# Vivado block design Minimig_core_orig, xc7a200tfbg484-2, Vivado 2024.2.1
# (continued, part 2 of 3)
current_bd_instance /emu/CORE_cpu_wrapper/CORE_cpu_wrapper_cpu_inst_p/CORE_cpu_inst_p_TG68K_ALU

# ---- hierarchy /emu/CORE_cpu_wrapper/CORE_cpu_wrapper_cpu_inst_o ----
current_bd_instance /emu/CORE_cpu_wrapper/CORE_cpu_wrapper_cpu_inst_o
create_bd_pin -dir I clk
create_bd_pin -dir I HALTn
create_bd_pin -dir I extReset
create_bd_pin -dir I pwrUp
create_bd_pin -dir I enPhi1
create_bd_pin -dir I enPhi2
create_bd_pin -dir O eRWn
create_bd_pin -dir O ASn
create_bd_pin -dir O LDSn
create_bd_pin -dir O UDSn
create_bd_pin -dir O E
create_bd_pin -dir O VMAn
create_bd_pin -dir O E_PosClkEn
create_bd_pin -dir O E_NegClkEn
create_bd_pin -dir O FC0
create_bd_pin -dir O FC1
create_bd_pin -dir O FC2
create_bd_pin -dir O BGn
create_bd_pin -dir O oRESETn
create_bd_pin -dir O oHALTEDn
create_bd_pin -dir I DTACKn
create_bd_pin -dir I VPAn
create_bd_pin -dir I BERRn
create_bd_pin -dir I BRn
create_bd_pin -dir I BGACKn
create_bd_pin -dir I IPL0n
create_bd_pin -dir I IPL1n
create_bd_pin -dir I IPL2n
create_bd_pin -dir I -from 15 -to 0 iEdb
create_bd_pin -dir I -from 15 -to 0 oEdb
create_bd_pin -dir O -from 23 -to 1 eab

# ---- hierarchy /emu/CORE_cpu_wrapper/ipl_logic ----
current_bd_instance /emu/CORE_cpu_wrapper/ipl_logic
create_bd_pin -dir I -from 2 -to 0 chip_ipl
create_bd_pin -dir O IPL0n
create_bd_pin -dir O IPL1n
create_bd_pin -dir O IPL2n
create_bd_pin -dir O -from 2 -to 0 IPL

# ---- hierarchy /emu/CORE_cpu_wrapper/iEdb_logic ----
current_bd_instance /emu/CORE_cpu_wrapper/iEdb_logic
create_bd_pin -dir O -from 15 -to 0 iEDB
create_bd_pin -dir I -from 15 -to 0 fastchip_dout
create_bd_pin -dir I -from 15 -to 0 chip_dout
create_bd_pin -dir I -from 15 -to 0 ramdout
create_bd_pin -dir I -from 7 -to 0 fastramcfg

# ---- hierarchy /emu/CORE_cpu_wrapper/clkene_in_logic ----
current_bd_instance /emu/CORE_cpu_wrapper/clkene_in_logic
create_bd_pin -dir O clkena_in
create_bd_pin -dir I fastchip_ready
create_bd_pin -dir I ramready

# ---- hierarchy /emu/CORE_cpu_wrapper/DTACKn_logic ----
current_bd_instance /emu/CORE_cpu_wrapper/DTACKn_logic
create_bd_pin -dir O DTACKn
create_bd_pin -dir I fastchip_selack
create_bd_pin -dir I chip_dtack

# ---- hierarchy /emu/CORE_cpu_wrapper/cpustate_logic ----
current_bd_instance /emu/CORE_cpu_wrapper/cpustate_logic
create_bd_pin -dir O -from 1 -to 0 cpustate
create_bd_pin -dir I -from 1 -to 0 busstate
create_bd_pin -dir I ASn

# ---- hierarchy /emu/CORE_cpu_wrapper/VPAn_logic ----
current_bd_instance /emu/CORE_cpu_wrapper/VPAn_logic
create_bd_pin -dir O VPAn
create_bd_pin -dir I FC0
create_bd_pin -dir I FC1
create_bd_pin -dir I FC2

# ---- hierarchy /emu/CORE_cpu_wrapper/ramdout_logic ----
current_bd_instance /emu/CORE_cpu_wrapper/ramdout_logic
create_bd_pin -dir I -from 15 -to 0 ramdout
create_bd_pin -dir O -from 15 -to 0 data_in
create_bd_pin -dir O -from 15 -to 0 ramdout_o

# ---- hierarchy /emu/CORE_cpu_wrapper/fastchip_rnw_logic ----
current_bd_instance /emu/CORE_cpu_wrapper/fastchip_rnw_logic
create_bd_pin -dir O fastchip_rnw
create_bd_pin -dir I nWr
create_bd_pin -dir I eRWn

# ---- hierarchy /emu/CORE_cpu_wrapper/fastchip_uds_logic ----
current_bd_instance /emu/CORE_cpu_wrapper/fastchip_uds_logic
create_bd_pin -dir O fastchip_uds
create_bd_pin -dir I pnUDS
create_bd_pin -dir I o_UDSn

# ---- hierarchy /emu/CORE_cpu_wrapper/chip_uds_logic ----
current_bd_instance /emu/CORE_cpu_wrapper/chip_uds_logic
create_bd_pin -dir O chip_uds
create_bd_pin -dir I o_UDSn
create_bd_pin -dir I pnUDS

# ---- hierarchy /emu/CORE_cpu_wrapper/fastchip_lds ----
current_bd_instance /emu/CORE_cpu_wrapper/fastchip_lds
create_bd_pin -dir O fastchip_lds
create_bd_pin -dir I p_nLDS
create_bd_pin -dir I o_LDSn

# ---- hierarchy /emu/CORE_cpu_wrapper/ramlds_logic ----
current_bd_instance /emu/CORE_cpu_wrapper/ramlds_logic
create_bd_pin -dir O ramlds
create_bd_pin -dir I p_nUDS
create_bd_pin -dir I o_UDSn

# ---- hierarchy /emu/CORE_cpu_wrapper/reset_out_logic ----
current_bd_instance /emu/CORE_cpu_wrapper/reset_out_logic
create_bd_pin -dir O reset_out
create_bd_pin -dir I p_nResetOut
create_bd_pin -dir I oRESTn

# ---- hierarchy /emu/CORE_cpu_wrapper/ramuds_logic ----
current_bd_instance /emu/CORE_cpu_wrapper/ramuds_logic
create_bd_pin -dir O ramuds
create_bd_pin -dir I p_nUDS
create_bd_pin -dir I o_UDSn
create_bd_pin -dir I p_nLDS
create_bd_pin -dir I o_LDSn

# ---- hierarchy /emu/CORE_cpu_wrapper/ramaddr_logic ----
current_bd_instance /emu/CORE_cpu_wrapper/ramaddr_logic
create_bd_pin -dir O -from 28 -to 1 ramaddr
create_bd_pin -dir I bootrom
create_bd_pin -dir I -from 23 -to 1 eab

# ---- hierarchy /emu/CORE_cpu_wrapper/data_in_logic ----
current_bd_instance /emu/CORE_cpu_wrapper/data_in_logic
create_bd_pin -dir O -from 15 -to 0 data_in
create_bd_pin -dir I -from 15 -to 0 data_in_i
create_bd_pin -dir I -from 7 -to 0 fastramcfg

# ---- hierarchy /emu/CORE_video_mixer ----
current_bd_instance /emu/CORE_video_mixer
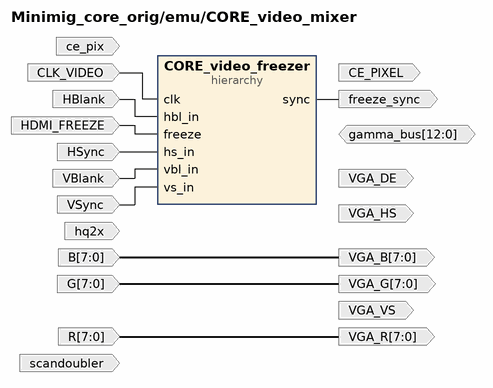
[diagram p14: block diagram inside /emu/CORE_video_mixer]
create_bd_pin -dir I CLK_VIDEO
create_bd_pin -dir O CE_PIXEL
create_bd_pin -dir I ce_pix
create_bd_pin -dir I scandoubler
create_bd_pin -dir I hq2x
create_bd_pin -dir IO -from 12 -to 0 gamma_bus
create_bd_pin -dir I -from 7 -to 0 R
create_bd_pin -dir I -from 7 -to 0 G
create_bd_pin -dir I -from 7 -to 0 B
create_bd_pin -dir I HSync
create_bd_pin -dir I VSync
create_bd_pin -dir I HBlank
create_bd_pin -dir I VBlank
create_bd_pin -dir I HDMI_FREEZE
create_bd_pin -dir O freeze_sync
create_bd_pin -dir O -from 7 -to 0 VGA_R
create_bd_pin -dir O -from 7 -to 0 VGA_G
create_bd_pin -dir O -from 7 -to 0 VGA_B
create_bd_pin -dir O VGA_VS
create_bd_pin -dir O VGA_HS
create_bd_pin -dir O VGA_DE

create_bd_cell -type hier CORE_video_freezer

# ---- hierarchy /emu/CORE_video_mixer/CORE_video_freezer ----
current_bd_instance /emu/CORE_video_mixer/CORE_video_freezer
create_bd_pin -dir I clk
create_bd_pin -dir O sync
create_bd_pin -dir I freeze
create_bd_pin -dir I hs_in
create_bd_pin -dir I vs_in
create_bd_pin -dir I hbl_in
create_bd_pin -dir I vbl_in
create_bd_pin -dir O hs_out
create_bd_pin -dir O vs_out
create_bd_pin -dir O hbl_out
create_bd_pin -dir O vbl_out

# ---- hierarchy /emu/hps_ext ----
current_bd_instance /emu/hps_ext
create_bd_pin -dir I clk_sys
create_bd_pin -dir IO -from 35 -to 0 EXT_BUS
create_bd_pin -dir O io_strobe
create_bd_pin -dir O io_fpga
create_bd_pin -dir O io_uio
create_bd_pin -dir O -from 15 -to 0 io_din
create_bd_pin -dir I -from 15 -to 0 fpga_dout
create_bd_pin -dir I -from 15 -to 0 ide_din
create_bd_pin -dir O -from 15 -to 0 ide_dout
create_bd_pin -dir O -from 4 -to 0 ide_addr
create_bd_pin -dir O ide_rd
create_bd_pin -dir O ide_wr
create_bd_pin -dir I -from 5 -to 0 ide_req
create_bd_pin -dir O -from 2 -to 0 mouse_buttons
create_bd_pin -dir O kbd_mouse_level
create_bd_pin -dir O -from 1 -to 0 kbd_mouse_type
create_bd_pin -dir O -from 7 -to 0 kbd_mouse_data
create_bd_pin -dir I -from 11 -to 0 scr_hbl_l
create_bd_pin -dir I -from 11 -to 0 scr_hbl_r
create_bd_pin -dir I -from 11 -to 0 scr_hsize
create_bd_pin -dir I -from 11 -to 0 scr_vbl_t
create_bd_pin -dir I -from 11 -to 0 scr_vbl_b
create_bd_pin -dir I -from 11 -to 0 scr_vsize
create_bd_pin -dir I -from 6 -to 0 scr_flg
create_bd_pin -dir I -from 1 -to 0 scr_res
create_bd_pin -dir O -from 11 -to 0 shbl_l
create_bd_pin -dir O -from 11 -to 0 shbl_r
create_bd_pin -dir O -from 11 -to 0 svbl_t
create_bd_pin -dir O -from 11 -to 0 svbl_b
create_bd_pin -dir O sset
create_bd_pin -dir I cdda_req
create_bd_pin -dir O cdda_wr
create_bd_pin -dir O -from 15 -to 0 cdda_dout

# ---- hierarchy /emu/iir_filter_lpf3275 ----
current_bd_instance /emu/iir_filter_lpf3275
create_bd_pin -dir I clk
create_bd_pin -dir I reset
create_bd_pin -dir I ce
create_bd_pin -dir I sample_ce
create_bd_pin -dir I -from 39 -to 0 cx
create_bd_pin -dir I -from 7 -to 0 cx0
create_bd_pin -dir I -from 7 -to 0 cx1
create_bd_pin -dir I -from 7 -to 0 cx2
create_bd_pin -dir I -from 23 -to 0 cy0
create_bd_pin -dir I -from 23 -to 0 cy1
create_bd_pin -dir I -from 23 -to 0 cy2
create_bd_pin -dir I -from 15 -to 0 input_l
create_bd_pin -dir I -from 15 -to 0 input_r
create_bd_pin -dir O -from 15 -to 0 output_l
create_bd_pin -dir O -from 15 -to 0 output_r

# ---- hierarchy /emu/iir_filter_lpf4400 ----
current_bd_instance /emu/iir_filter_lpf4400
create_bd_pin -dir I clk
create_bd_pin -dir I reset
create_bd_pin -dir I sample_ce
create_bd_pin -dir I -from 39 -to 0 cx
create_bd_pin -dir I -from 7 -to 0 cx0
create_bd_pin -dir I -from 7 -to 0 cx1
create_bd_pin -dir I -from 7 -to 0 cx2
create_bd_pin -dir I -from 23 -to 0 cy0
create_bd_pin -dir I -from 23 -to 0 cy1
create_bd_pin -dir I -from 23 -to 0 cy2
create_bd_pin -dir I -from 15 -to 0 input_l
create_bd_pin -dir I -from 15 -to 0 input_r
create_bd_pin -dir O -from 15 -to 0 output_l
create_bd_pin -dir O -from 15 -to 0 output_r
create_bd_pin -dir I ce

# ---- hierarchy /emu/Audio_logic ----
current_bd_instance /emu/Audio_logic
create_bd_pin -dir O -from 15 -to 0 AUDIO_L
create_bd_pin -dir O -from 15 -to 0 AUDIO_R
create_bd_pin -dir I -from 15 -to 0 output_l
create_bd_pin -dir I -from 15 -to 0 output_r
create_bd_pin -dir I -from 15 -to 0 cdda_audio_l
create_bd_pin -dir I -from 15 -to 0 cdda_audio_r
create_bd_pin -dir I -from 15 -to 0 toccata_aud_left
create_bd_pin -dir I -from 15 -to 0 toccata_aud_right
create_bd_pin -dir I -from 15 -to 0 mt32_i2s_r
create_bd_pin -dir I -from 15 -to 0 mt32_i2s_l

# ---- hierarchy /emu/iir_4400_logic ----
current_bd_instance /emu/iir_4400_logic
create_bd_pin -dir I -from 15 -to 0 ldata
create_bd_pin -dir O -from 15 -to 0 comb
create_bd_pin -dir I -from 15 -to 0 rdata

# ---- hierarchy /emu/iir_3275_logic ----
current_bd_instance /emu/iir_3275_logic
create_bd_pin -dir I -from 15 -to 0 comb_i
create_bd_pin -dir I -from 31 -to 0 output_l
create_bd_pin -dir I -from 15 -to 0 output_r
create_bd_pin -dir O -from 15 -to 0 comb

# ---- hierarchy /emu/iir_comb_logic ----
current_bd_instance /emu/iir_comb_logic
create_bd_pin -dir O -from 15 -to 0 output_l
create_bd_pin -dir O -from 15 -to 0 output_r
create_bd_pin -dir I -from 15 -to 0 output_l_i
create_bd_pin -dir I -from 15 -to 0 output_r_i
create_bd_pin -dir I -from 15 -to 0 comb

# ---- hierarchy /emu/amiga_clk_login ----
current_bd_instance /emu/amiga_clk_login
create_bd_pin -dir I clk7_en
create_bd_pin -dir I clk7n_en
create_bd_pin -dir O ce

# ---- hierarchy /emu/reset_logic ----
current_bd_instance /emu/reset_logic
create_bd_pin -dir I RESET
create_bd_pin -dir I pll_locked
create_bd_pin -dir I hps_io_buttons
create_bd_pin -dir O reset_o

# ---- hierarchy /emu/fastchip_reset_logic ----
current_bd_instance /emu/fastchip_reset_logic
create_bd_pin -dir O reset
create_bd_pin -dir I minimig_cpu_reset
create_bd_pin -dir I wrapper_reset_out

# ---- hierarchy /emu/cpu_wrapper_logic ----
current_bd_instance /emu/cpu_wrapper_logic
create_bd_pin -dir O -from 15 -to 0 ramdout
create_bd_pin -dir O -from 15 -to 0 ramready
create_bd_pin -dir I -from 15 -to 0 ram1_cpuRD
create_bd_pin -dir I ram1_ramready
create_bd_pin -dir I -from 15 -to 0 ram2_cpuRD
create_bd_pin -dir I ram2_ramready

# ---- hierarchy /emu/CORE_video_freak ----
current_bd_instance /emu/CORE_video_freak
create_bd_pin -dir I CLK_VIDEO
create_bd_pin -dir I CE_PIXEL
create_bd_pin -dir I VGA_VS
create_bd_pin -dir I -from 11 -to 0 HDMI_WIDTH
create_bd_pin -dir I -from 11 -to 0 HDMI_HEIGHT
create_bd_pin -dir O VGA_DE
create_bd_pin -dir O -from 12 -to 0 VIDEO_ARX
create_bd_pin -dir O -from 12 -to 0 VIDEO_ARY
create_bd_pin -dir I VGA_DE_IN
create_bd_pin -dir I -from 11 -to 0 ARX
create_bd_pin -dir I -from 11 -to 0 ARY
create_bd_pin -dir I -from 11 -to 0 CROP_SIZE
create_bd_pin -dir I -from 4 -to 0 CROP_OFF
create_bd_pin -dir I -from 2 -to 0 SCALE

# ---- hierarchy /emu/mt32pi ----
current_bd_instance /emu/mt32pi
create_bd_pin -dir I CLK_AUDIO
create_bd_pin -dir I CLK_VIDEO
create_bd_pin -dir I CE_PIXEL
create_bd_pin -dir I VGA_VS
create_bd_pin -dir I VGA_DE
create_bd_pin -dir I -from 6 -to 0 USER_IN
create_bd_pin -dir O -from 6 -to 0 USER_OUT
create_bd_pin -dir I reset
create_bd_pin -dir I midi_tx
create_bd_pin -dir O midi_rx
create_bd_pin -dir O -from 15 -to 0 mt32_i2s_r
create_bd_pin -dir O -from 15 -to 0 mt32_i2s_l
create_bd_pin -dir O mt32_available
create_bd_pin -dir I mt32_mode_req
create_bd_pin -dir I -from 1 -to 0 mt32_rom_req
create_bd_pin -dir I -from 7 -to 0 mt32_sf_req
create_bd_pin -dir O -from 7 -to 0 mt32_mode
create_bd_pin -dir O -from 7 -to 0 mt32_rom
create_bd_pin -dir O -from 7 -to 0 mt32_sf
create_bd_pin -dir O mt32_newmode
create_bd_pin -dir O mt32_lcd_en
create_bd_pin -dir O mt32_lcd_pix
create_bd_pin -dir O mt32_lcd_update

# ---- hierarchy /emu/status_menumask_logic ----
current_bd_instance /emu/status_menumask_logic
create_bd_pin -dir O -from 15 -to 0 status_menumask
create_bd_pin -dir I -from 7 -to 0 mt32_rom
create_bd_pin -dir I -from 7 -to 0 mt32_sf

# ---- hierarchy /hdmi_osd ----
current_bd_instance /hdmi_osd
create_bd_pin -dir I clk_sys
create_bd_pin -dir I io_osd
create_bd_pin -dir I io_strobe
create_bd_pin -dir I -from 15 -to 0 io_din
create_bd_pin -dir I clk_video
create_bd_pin -dir I -from 23 -to 0 din
create_bd_pin -dir I de_in
create_bd_pin -dir I vs_in
create_bd_pin -dir I hs_in
create_bd_pin -dir O -from 23 -to 0 dout
create_bd_pin -dir O de_out
create_bd_pin -dir O vs_out
create_bd_pin -dir O hs_out
create_bd_pin -dir O osd_status

# ---- hierarchy /mcp23009 ----
current_bd_instance /mcp23009
create_bd_pin -dir I clk
create_bd_pin -dir O -from 2 -to 0 btn
create_bd_pin -dir I -from 2 -to 0 led
create_bd_pin -dir O flg_sd_cd
create_bd_pin -dir O flg_present
create_bd_pin -dir O flg_mode
create_bd_pin -dir O scl
create_bd_pin -dir IO sda

# ---- hierarchy /pll_audio_0002 ----
current_bd_instance /pll_audio_0002
create_bd_pin -dir I refclk
create_bd_pin -dir I rst
create_bd_pin -dir O outclk_0
create_bd_pin -dir O locked

# ---- hierarchy /pll_cfg_hdmi ----
current_bd_instance /pll_cfg_hdmi
create_bd_pin -dir I mgmt_clk
create_bd_pin -dir I mgmt_reset
create_bd_pin -dir O -from 63 -to 0 reconfig_to_pll
create_bd_pin -dir I -from 63 -to 0 reconfig_from_pll
create_bd_pin -dir O mgmt_waitrequest
create_bd_pin -dir I -from 5 -to 0 mgmt_address
create_bd_pin -dir I mgmt_write
create_bd_pin -dir I -from 31 -to 0 mgmt_writedata

# ---- hierarchy /pll_hdmi_0002 ----
current_bd_instance /pll_hdmi_0002
create_bd_pin -dir I refclk
create_bd_pin -dir I rst
create_bd_pin -dir O outclk_0
create_bd_pin -dir O locked
create_bd_pin -dir I -from 63 -to 0 reconfig_to_pll
create_bd_pin -dir O -from 63 -to 0 reconfig_from_pll

# ---- hierarchy /pll_hdmi_adj ----
current_bd_instance /pll_hdmi_adj
create_bd_pin -dir I llena
create_bd_pin -dir I -from 15 -to 0 lltune
create_bd_pin -dir O locked
create_bd_pin -dir O i_waitrequest
create_bd_pin -dir I i_write
create_bd_pin -dir I -from 5 -to 0 i_address
create_bd_pin -dir I -from 31 -to 0 i_writedata
create_bd_pin -dir I o_waitrequest
create_bd_pin -dir O o_write
create_bd_pin -dir O -from 5 -to 0 o_address
create_bd_pin -dir O -from 31 -to 0 o_writedata
create_bd_pin -dir I clk
create_bd_pin -dir I reset_na

# ---- hierarchy /sysmem_lite ----
current_bd_instance /sysmem_lite
create_bd_pin -dir O clock
create_bd_pin -dir O reset_out
create_bd_pin -dir I reset_hps_cold_req
create_bd_pin -dir I reset_hps_warm_req
create_bd_pin -dir I reset_core_req
create_bd_pin -dir I ram1_clk
create_bd_pin -dir I -from 28 -to 0 ram1_address
create_bd_pin -dir I -from 7 -to 0 ram1_burstcount
create_bd_pin -dir O ram1_waitrequest
create_bd_pin -dir O -from 63 -to 0 ram1_readdata
create_bd_pin -dir O ram1_readdatavalid
create_bd_pin -dir I ram1_read
create_bd_pin -dir I -from 63 -to 0 ram1_writedata
create_bd_pin -dir I -from 7 -to 0 ram1_byteenable
create_bd_pin -dir I ram1_write
create_bd_pin -dir I ram2_clk
create_bd_pin -dir I -from 28 -to 0 ram2_address
create_bd_pin -dir I -from 7 -to 0 ram2_burstcount
create_bd_pin -dir O ram2_waitrequest
create_bd_pin -dir O -from 63 -to 0 ram2_readdata
create_bd_pin -dir O ram2_readdatavalid
create_bd_pin -dir I ram2_read
create_bd_pin -dir I -from 63 -to 0 ram2_writedata
create_bd_pin -dir I -from 7 -to 0 ram2_byteenable
create_bd_pin -dir I ram2_write
create_bd_pin -dir I vbuf_clk
create_bd_pin -dir I -from 27 -to 0 vbuf_address
create_bd_pin -dir I -from 7 -to 0 vbuf_burstcount
create_bd_pin -dir O vbuf_waitrequest
create_bd_pin -dir O -from 127 -to 0 vbuf_readdata
create_bd_pin -dir O vbuf_readdatavalid
create_bd_pin -dir I vbuf_read
create_bd_pin -dir I -from 127 -to 0 vbuf_writedata
create_bd_pin -dir I -from 15 -to 0 vbuf_byteenable
create_bd_pin -dir I vbuf_write

# ---- hierarchy /vga_out ----
current_bd_instance /vga_out
create_bd_pin -dir I clk
create_bd_pin -dir I ypbpr_en
create_bd_pin -dir I hsync
create_bd_pin -dir I vsync
create_bd_pin -dir I csync
create_bd_pin -dir I de
create_bd_pin -dir I -from 23 -to 0 din
create_bd_pin -dir O -from 23 -to 0 dout
create_bd_pin -dir O hsync_o
create_bd_pin -dir O vsync_o
create_bd_pin -dir O csync_o
create_bd_pin -dir O de_o

# ---- hierarchy /yc_out ----
current_bd_instance /yc_out
create_bd_pin -dir I clk
create_bd_pin -dir I -from 39 -to 0 PHASE_INC
create_bd_pin -dir I PAL_EN
create_bd_pin -dir I CVBS
create_bd_pin -dir I -from 16 -to 0 COLORBURST_RANGE
create_bd_pin -dir I hsync
create_bd_pin -dir I vsync
create_bd_pin -dir I csync
create_bd_pin -dir I de
create_bd_pin -dir I -from 23 -to 0 din
create_bd_pin -dir O -from 23 -to 0 dout
create_bd_pin -dir O hsync_o
create_bd_pin -dir O vsync_o
create_bd_pin -dir O csync_o
create_bd_pin -dir O de_o

# ---- hierarchy /vga_osd ----
current_bd_instance /vga_osd
create_bd_pin -dir I clk_sys
create_bd_pin -dir I io_osd
create_bd_pin -dir I io_strobe
create_bd_pin -dir I -from 15 -to 0 io_din
create_bd_pin -dir I clk_video
create_bd_pin -dir I -from 23 -to 0 din
create_bd_pin -dir I de_in
create_bd_pin -dir I vs_in
create_bd_pin -dir I hs_in
create_bd_pin -dir O -from 23 -to 0 dout
create_bd_pin -dir O de_out
create_bd_pin -dir O vs_out
create_bd_pin -dir O hs_out
create_bd_pin -dir O osd_status

# ---- hierarchy /VGA_scanline_logic ----
current_bd_instance /VGA_scanline_logic
create_bd_pin -dir I -from 7 -to 0 r_out
create_bd_pin -dir I -from 7 -to 0 g_out
create_bd_pin -dir I -from 7 -to 0 b_out
create_bd_pin -dir O -from 23 -to 0 din
create_bd_pin -dir I de_emu

# ---- hierarchy /spi ----
current_bd_instance /spi
create_bd_pin -dir I RXD
create_bd_pin -dir I SS_IN_N
create_bd_pin -dir O SCLK_OUT
create_bd_pin -dir O SS_O_N
create_bd_pin -dir O TXD

# ---- connections ----

current_bd_instance /emu
connect_bd_net [get_bd_pins Audio_logic/AUDIO_L] [get_bd_pins AUDIO_L]
connect_bd_net [get_bd_pins Audio_logic/AUDIO_R] [get_bd_pins AUDIO_R]
connect_bd_net [get_bd_pins CLK_50M] [get_bd_pins pll_pll/refclk] [get_bd_pins pll_cfg/mgmt_clk]
connect_bd_net [get_bd_pins CLK_AUDIO] [get_bd_pins mt32pi/CLK_AUDIO]
connect_bd_net [get_bd_pins CORE_Main_Minimig/IO_DOUT] [get_bd_pins hps_ext/fpga_dout]
connect_bd_net [get_bd_pins CORE_Main_Minimig/IO_WAIT] [get_bd_pins hps_io/ioctl_wait]
connect_bd_net [get_bd_pins CORE_Main_Minimig/ar] [get_bd_pins CORE_video_freak/ARX] [get_bd_pins CORE_video_freak/ARY]
connect_bd_net [get_bd_pins CORE_Main_Minimig/aud_mix] [get_bd_pins AUDIO_MIX]
connect_bd_net [get_bd_pins CORE_Main_Minimig/blue] [get_bd_pins CORE_video_mixer/B]
connect_bd_net [get_bd_pins CORE_Main_Minimig/bootrom] [get_bd_pins CORE_cpu_wrapper/bootrom]
connect_bd_net [get_bd_pins CORE_Main_Minimig/cachecfg] [get_bd_pins CORE_cpu_wrapper/cachecfg]
connect_bd_net [get_bd_pins CORE_Main_Minimig/cpu_data] [get_bd_pins CORE_cpu_wrapper/chip_dout]
connect_bd_net [get_bd_pins CORE_Main_Minimig/cpucfg] [get_bd_pins CORE_cpu_wrapper/cpucfg]
connect_bd_net [get_bd_pins CORE_Main_Minimig/dtr] [get_bd_pins UART_DTR]
connect_bd_net [get_bd_pins CORE_Main_Minimig/fdd_led] [get_bd_pins LED_USER]
connect_bd_net [get_bd_pins CORE_Main_Minimig/field1] [get_bd_pins VGA_F1]
connect_bd_net [get_bd_pins CORE_Main_Minimig/green] [get_bd_pins CORE_video_mixer/G]
connect_bd_net [get_bd_pins CORE_Main_Minimig/hblank] [get_bd_pins CORE_video_mixer/HBlank]
connect_bd_net [get_bd_pins CORE_Main_Minimig/hdd_led] [get_bd_pins LED_DISK]
connect_bd_net [get_bd_pins CORE_Main_Minimig/ide_ena] [get_bd_pins CORE_Main_fastchip/ide_ena]
connect_bd_net [get_bd_pins CORE_Main_Minimig/ldata] [get_bd_pins iir_4400_logic/ldata]
connect_bd_net [get_bd_pins CORE_Main_Minimig/memcfg] [get_bd_pins CORE_cpu_wrapper/fastramcfg]
connect_bd_net [get_bd_pins CORE_Main_Minimig/ntsc] [get_bd_pins pll_cfg/mgmt_address]
connect_bd_net [get_bd_pins CORE_Main_Minimig/pwr_led] [get_bd_pins LED_POWER]
connect_bd_net [get_bd_pins CORE_Main_Minimig/ram_address] [get_bd_pins CORE_sdram_ctrl_ram1/chipAddr]
connect_bd_net [get_bd_pins CORE_Main_Minimig/rdata] [get_bd_pins iir_4400_logic/rdata]
connect_bd_net [get_bd_pins CORE_Main_Minimig/red] [get_bd_pins CORE_video_mixer/R]
connect_bd_net [get_bd_pins CORE_Main_Minimig/rts] [get_bd_pins UART_RTS]
connect_bd_net [get_bd_pins CORE_Main_Minimig/scanline] [get_bd_pins VGA_SL]
connect_bd_net [get_bd_pins CORE_Main_Minimig/toccata_aud_left] [get_bd_pins Audio_logic/toccata_aud_left]
connect_bd_net [get_bd_pins CORE_Main_Minimig/toccata_aud_right] [get_bd_pins Audio_logic/toccata_aud_right]
connect_bd_net [get_bd_pins CORE_Main_Minimig/txd] [get_bd_pins UART_TXD]
connect_bd_net [get_bd_pins CORE_Main_Minimig/vblank] [get_bd_pins CORE_video_mixer/VBlank]
connect_bd_net [get_bd_pins CORE_Main_Minimig/x_cpu_dtack] [get_bd_pins CORE_cpu_wrapper/chip_dtack]
connect_bd_net [get_bd_pins CORE_Main_Minimig/x_cpu_ipl] [get_bd_pins CORE_cpu_wrapper/chip_ipl]
connect_bd_net [get_bd_pins CORE_Main_Minimig/x_cpu_reset] \
  [get_bd_pins CORE_cpu_wrapper/reset] [get_bd_pins fastchip_reset_logic/minimig_cpu_reset] \
  [get_bd_pins CORE_sdram_ctrl_ram1/cache_rst] [get_bd_pins CORE_ddram_ctrl_ram2/cache_rst]
connect_bd_net [get_bd_pins CORE_Main_Minimig/x_hsync] [get_bd_pins CORE_video_mixer/HSync]
connect_bd_net [get_bd_pins CORE_Main_Minimig/x_ram_bhe] [get_bd_pins CORE_sdram_ctrl_ram1/chipU]
connect_bd_net [get_bd_pins CORE_Main_Minimig/x_ram_ble] [get_bd_pins CORE_sdram_ctrl_ram1/chipL]
connect_bd_net [get_bd_pins CORE_Main_Minimig/x_ram_oe] [get_bd_pins CORE_sdram_ctrl_ram1/chipDMA]
connect_bd_net [get_bd_pins CORE_Main_Minimig/x_ram_we] [get_bd_pins CORE_sdram_ctrl_ram1/chipRW]
connect_bd_net [get_bd_pins CORE_Main_Minimig/x_vsync] [get_bd_pins CORE_video_mixer/VSync]
connect_bd_net [get_bd_pins CORE_Main_fastchip/dout] [get_bd_pins CORE_cpu_wrapper/fastchip_dout]
connect_bd_net [get_bd_pins CORE_Main_fastchip/ide_irq] [get_bd_pins CORE_Main_Minimig/ide_ext_irq]
connect_bd_net [get_bd_pins CORE_Main_fastchip/rtg_base] [get_bd_pins FB_BASE]
connect_bd_net [get_bd_pins CORE_Main_fastchip/rtg_ena] [get_bd_pins FB_EN]
connect_bd_net [get_bd_pins CORE_Main_fastchip/rtg_format] [get_bd_pins FB_FORMAT]
connect_bd_net [get_bd_pins CORE_Main_fastchip/rtg_hsize] [get_bd_pins FB_WIDTH]
connect_bd_net [get_bd_pins CORE_Main_fastchip/rtg_pal_a] [get_bd_pins FB_PAL_ADDR]
connect_bd_net [get_bd_pins CORE_Main_fastchip/rtg_pal_clk] [get_bd_pins FB_PAL_CLK]
connect_bd_net [get_bd_pins CORE_Main_fastchip/rtg_pal_dw] [get_bd_pins FB_PAL_DOUT]
connect_bd_net [get_bd_pins CORE_Main_fastchip/rtg_pal_wr] [get_bd_pins FB_PAL_WR]
connect_bd_net [get_bd_pins CORE_Main_fastchip/rtg_stride] [get_bd_pins FB_STRIDE]
connect_bd_net [get_bd_pins CORE_Main_fastchip/rtg_vsize] [get_bd_pins FB_HEIGHT]
connect_bd_net [get_bd_pins CORE_cpu_wrapper/cacr] [get_bd_pins CORE_ddram_ctrl_ram2/cpu_cache_ctrl] [get_bd_pins CORE_sdram_ctrl_ram1/cpu_cache_ctrl]
connect_bd_net [get_bd_pins CORE_cpu_wrapper/cpustate] [get_bd_pins CORE_ddram_ctrl_ram2/cpustate] [get_bd_pins CORE_sdram_ctrl_ram1/cpustate]
connect_bd_net [get_bd_pins CORE_cpu_wrapper/fastchip_lds] [get_bd_pins CORE_Main_fastchip/lds]
connect_bd_net [get_bd_pins CORE_cpu_wrapper/fastchip_lw] [get_bd_pins CORE_Main_fastchip/longword]
connect_bd_net [get_bd_pins CORE_cpu_wrapper/fastchip_rnw] [get_bd_pins CORE_Main_fastchip/rnw]
connect_bd_net [get_bd_pins CORE_cpu_wrapper/fastchip_sel] [get_bd_pins CORE_Main_fastchip/sel]
connect_bd_net [get_bd_pins CORE_cpu_wrapper/fastchip_uds] [get_bd_pins CORE_Main_fastchip/uds]
connect_bd_net [get_bd_pins CORE_cpu_wrapper/ramaddr] \
  [get_bd_pins CORE_ddram_ctrl_ram2/cpuAddr] [get_bd_pins CORE_sdram_ctrl_ram1/cpuAddr] \
  [get_bd_pins CORE_sdram_ctrl_ram1/cpuCS] [get_bd_pins CORE_ddram_ctrl_ram2/cpuCS]
connect_bd_net [get_bd_pins CORE_cpu_wrapper/ramdin] [get_bd_pins CORE_ddram_ctrl_ram2/cpuWR] [get_bd_pins CORE_sdram_ctrl_ram1/cpuWR]
connect_bd_net [get_bd_pins CORE_cpu_wrapper/ramlds] [get_bd_pins CORE_ddram_ctrl_ram2/cpuL] [get_bd_pins CORE_sdram_ctrl_ram1/cpuL]
connect_bd_net [get_bd_pins CORE_cpu_wrapper/ramshared] [get_bd_pins CORE_ddram_ctrl_ram2/ramshared]
connect_bd_net [get_bd_pins CORE_cpu_wrapper/ramuds] [get_bd_pins CORE_ddram_ctrl_ram2/cpuU] [get_bd_pins CORE_sdram_ctrl_ram1/cpuU]
connect_bd_net [get_bd_pins CORE_cpu_wrapper/toccata_base] [get_bd_pins CORE_Main_Minimig/toccata_base]
connect_bd_net [get_bd_pins CORE_cpu_wrapper/toccata_ena] [get_bd_pins CORE_Main_Minimig/toccata_ena]
connect_bd_net [get_bd_pins CORE_ddram_ctrl_ram2/DDRAM_ADDR] [get_bd_pins DDRAM_ADDR]
connect_bd_net [get_bd_pins CORE_ddram_ctrl_ram2/DDRAM_BE] [get_bd_pins DDRAM_BE]
connect_bd_net [get_bd_pins CORE_ddram_ctrl_ram2/DDRAM_BURSTCNT] [get_bd_pins DDRAM_BURSTCNT]
connect_bd_net [get_bd_pins CORE_ddram_ctrl_ram2/DDRAM_CLK] [get_bd_pins DDRAM_CLK]
connect_bd_net [get_bd_pins CORE_ddram_ctrl_ram2/DDRAM_DIN] [get_bd_pins DDRAM_DIN]
connect_bd_net [get_bd_pins CORE_ddram_ctrl_ram2/DDRAM_RD] [get_bd_pins DDRAM_RD]
connect_bd_net [get_bd_pins CORE_ddram_ctrl_ram2/DDRAM_WE] [get_bd_pins DDRAM_WE]
connect_bd_net [get_bd_pins CORE_ddram_ctrl_ram2/cpuRD] [get_bd_pins cpu_wrapper_logic/ram2_cpuRD]
connect_bd_net [get_bd_pins CORE_ddram_ctrl_ram2/ramready] [get_bd_pins cpu_wrapper_logic/ram2_ramready]
connect_bd_net [get_bd_pins CORE_sdram_ctrl_ram1/chipRD] [get_bd_pins CORE_Main_Minimig/ramdata_in]
connect_bd_net [get_bd_pins CORE_sdram_ctrl_ram1/cpuRD] [get_bd_pins cpu_wrapper_logic/ram1_cpuRD]
connect_bd_net [get_bd_pins CORE_sdram_ctrl_ram1/ramready] [get_bd_pins cpu_wrapper_logic/ram1_ramready]
connect_bd_net [get_bd_pins CORE_sdram_ctrl_ram1/sd_addr] [get_bd_pins SDRAM_A]
connect_bd_net [get_bd_pins CORE_sdram_ctrl_ram1/sd_ba] [get_bd_pins SDRAM_BA]
connect_bd_net [get_bd_pins CORE_sdram_ctrl_ram1/sd_cas] [get_bd_pins SDRAM_nCAS]
connect_bd_net [get_bd_pins CORE_sdram_ctrl_ram1/sd_cke] [get_bd_pins SDRAM_CKE]
connect_bd_net [get_bd_pins CORE_sdram_ctrl_ram1/sd_clk] [get_bd_pins SDRAM_CLK]
connect_bd_net [get_bd_pins CORE_sdram_ctrl_ram1/sd_cs] [get_bd_pins SDRAM_nCS]
connect_bd_net [get_bd_pins CORE_sdram_ctrl_ram1/sd_dqm] [get_bd_pins SDRAM_DQMH] [get_bd_pins SDRAM_DQML]
connect_bd_net [get_bd_pins CORE_sdram_ctrl_ram1/sd_ras] [get_bd_pins SDRAM_nRAS]
connect_bd_net [get_bd_pins CORE_sdram_ctrl_ram1/sd_we] [get_bd_pins SDRAM_nWE]
connect_bd_net [get_bd_pins CORE_video_freak/VIDEO_ARX] [get_bd_pins VIDEO_ARX]
connect_bd_net [get_bd_pins CORE_video_freak/VIDEO_ARY] [get_bd_pins VIDEO_ARY]
connect_bd_net [get_bd_pins CORE_video_mixer/CE_PIXEL] [get_bd_pins CORE_video_freak/CE_PIXEL]
connect_bd_net [get_bd_pins CORE_video_mixer/VGA_B] [get_bd_pins VGA_B]
connect_bd_net [get_bd_pins CORE_video_mixer/VGA_DE] [get_bd_pins VGA_DE] [get_bd_pins CORE_video_freak/VGA_DE_IN] [get_bd_pins mt32pi/VGA_DE]
connect_bd_net [get_bd_pins CORE_video_mixer/VGA_G] [get_bd_pins VGA_G]
connect_bd_net [get_bd_pins CORE_video_mixer/VGA_HS] [get_bd_pins VGA_HS]
connect_bd_net [get_bd_pins CORE_video_mixer/VGA_R] [get_bd_pins VGA_R]
connect_bd_net [get_bd_pins CORE_video_mixer/VGA_VS] [get_bd_pins VGA_VS] [get_bd_pins CORE_video_freak/VGA_VS] [get_bd_pins mt32pi/VGA_VS]
connect_bd_net [get_bd_pins DDRAM_BUSY] [get_bd_pins CORE_ddram_ctrl_ram2/DDRAM_BUSY]
connect_bd_net [get_bd_pins DDRAM_DOUT] [get_bd_pins CORE_ddram_ctrl_ram2/DDRAM_DOUT]
connect_bd_net [get_bd_pins DDRAM_DOUT_READY] [get_bd_pins CORE_ddram_ctrl_ram2/DDRAM_DOUT_READY]
connect_bd_net [get_bd_pins FB_PAL_DIN] [get_bd_pins CORE_Main_fastchip/rtg_pal_dr]
connect_bd_net [get_bd_pins HDMI_HEIGHT] [get_bd_pins CORE_video_freak/HDMI_HEIGHT]
connect_bd_net [get_bd_pins HDMI_WIDTH] [get_bd_pins CORE_video_freak/HDMI_WIDTH]
connect_bd_net [get_bd_pins HPS_BUS] [get_bd_pins hps_io/HPS_BUS_io_i]
connect_bd_net -net IO_DIN_1 [get_bd_pins hps_ext/io_din] [get_bd_pins CORE_Main_Minimig/IO_DIN]
connect_bd_net -net IO_FPGA_1 [get_bd_pins hps_ext/io_fpga] [get_bd_pins CORE_Main_Minimig/IO_FPGA]
connect_bd_net -net IO_STROBE_1 [get_bd_pins hps_ext/io_strobe] [get_bd_pins CORE_Main_Minimig/IO_STROBE]
connect_bd_net [get_bd_pins SDRAM_DQ] [get_bd_pins CORE_sdram_ctrl_ram1/sd_data]
connect_bd_net [get_bd_pins CORE_video_mixer/gamma_bus] [get_bd_pins hps_io/gamma_bus]
connect_bd_net [get_bd_pins hps_io/EXT_BUS] [get_bd_pins hps_ext/EXT_BUS]
connect_bd_net [get_bd_pins RESET] [get_bd_pins reset_logic/RESET]
connect_bd_net [get_bd_pins USER_IN] [get_bd_pins mt32pi/USER_IN]
connect_bd_net [get_bd_pins amiga_clk_0/c1] [get_bd_pins CORE_Main_Minimig/c1] [get_bd_pins CORE_sdram_ctrl_ram1/c_7m]
connect_bd_net [get_bd_pins amiga_clk_0/c3] [get_bd_pins CORE_Main_Minimig/c3]
connect_bd_net [get_bd_pins amiga_clk_0/cck] [get_bd_pins CORE_Main_Minimig/cck]
connect_bd_net [get_bd_pins amiga_clk_0/clk7_en] [get_bd_pins CORE_Main_Minimig/clk7_en] [get_bd_pins amiga_clk_login/clk7_en]
connect_bd_net [get_bd_pins amiga_clk_0/clk7n_en] [get_bd_pins CORE_Main_Minimig/clk7n_en] [get_bd_pins amiga_clk_login/clk7n_en]
connect_bd_net [get_bd_pins amiga_clk_0/eclk] [get_bd_pins CORE_Main_Minimig/eclk]
connect_bd_net [get_bd_pins amiga_clk_login/ce] [get_bd_pins iir_filter_lpf4400/ce] [get_bd_pins iir_filter_lpf3275/ce]
connect_bd_net [get_bd_pins cdda_0/AUDIO_L] [get_bd_pins Audio_logic/cdda_audio_l]
connect_bd_net [get_bd_pins cdda_0/AUDIO_R] [get_bd_pins Audio_logic/cdda_audio_r]
connect_bd_net [get_bd_pins cdda_0/WRITE_REQ] [get_bd_pins hps_ext/cdda_req]
connect_bd_net -net chip48_1 [get_bd_pins CORE_sdram_ctrl_ram1/chip48] [get_bd_pins CORE_Main_Minimig/chip48]
connect_bd_net -net chipWR_1 [get_bd_pins CORE_Main_Minimig/ram_data] [get_bd_pins CORE_sdram_ctrl_ram1/chipWR]
connect_bd_net -net cpu_address_1 [get_bd_pins CORE_cpu_wrapper/chip_addr] \
  [get_bd_pins CORE_Main_Minimig/cpu_address] [get_bd_pins CORE_Main_fastchip/addr]
connect_bd_net -net cpu_r_w_1 [get_bd_pins CORE_cpu_wrapper/chip_rw] [get_bd_pins CORE_Main_Minimig/cpu_r_w]
connect_bd_net [get_bd_pins cpu_wrapper_logic/ramdout] [get_bd_pins CORE_cpu_wrapper/ramdout]
connect_bd_net [get_bd_pins cpu_wrapper_logic/ramready] [get_bd_pins CORE_cpu_wrapper/ramready]
connect_bd_net -net cpudata_in_1 [get_bd_pins CORE_cpu_wrapper/chip_din] \
  [get_bd_pins CORE_Main_Minimig/cpudata_in] [get_bd_pins CORE_Main_fastchip/din]
connect_bd_net -net fastchip_ready_1 [get_bd_pins CORE_Main_fastchip/ready] [get_bd_pins CORE_cpu_wrapper/fastchip_ready]
connect_bd_net [get_bd_pins fastchip_reset_logic/reset] [get_bd_pins CORE_Main_fastchip/reset]
connect_bd_net -net fastchip_selack_1 [get_bd_pins CORE_Main_fastchip/sel_ack] [get_bd_pins CORE_cpu_wrapper/fastchip_selack]
connect_bd_net [get_bd_pins hps_ext/cdda_dout] [get_bd_pins cdda_0/DIN]
connect_bd_net [get_bd_pins hps_ext/cdda_wr] [get_bd_pins cdda_0/WRITE]
connect_bd_net [get_bd_pins hps_ext/io_uio] [get_bd_pins CORE_Main_Minimig/IO_UIO]
connect_bd_net [get_bd_pins hps_ext/kbd_mouse_data] [get_bd_pins CORE_Main_Minimig/kbd_mouse_data]
connect_bd_net [get_bd_pins hps_ext/kbd_mouse_type] [get_bd_pins CORE_Main_Minimig/kbd_mouse_type]
connect_bd_net [get_bd_pins hps_ext/mouse_buttons] [get_bd_pins CORE_Main_Minimig/mouse_btn]
connect_bd_net [get_bd_pins hps_io/RTC] [get_bd_pins CORE_Main_Minimig/rtc]
connect_bd_net [get_bd_pins hps_io/buttons] [get_bd_pins reset_logic/hps_io_buttons]
connect_bd_net [get_bd_pins hps_io/joystick_0] [get_bd_pins CORE_Main_Minimig/x_joy1]
connect_bd_net [get_bd_pins hps_io/joystick_3] [get_bd_pins CORE_Main_Minimig/x_joy4]
connect_bd_net [get_bd_pins hps_io/joystick_l_analog_0] [get_bd_pins CORE_Main_Minimig/joya1]
connect_bd_net [get_bd_pins hps_io/status] \
  [get_bd_pins CORE_video_freak/SCALE] [get_bd_pins mt32pi/midi_tx] [get_bd_pins mt32pi/mt32_mode_req] \
  [get_bd_pins mt32pi/mt32_rom_req] [get_bd_pins mt32pi/mt32_sf_req]
connect_bd_net -net ide_address_1 [get_bd_pins hps_ext/ide_addr] \
  [get_bd_pins CORE_Main_Minimig/ide_address] [get_bd_pins CORE_Main_fastchip/ide_address]
connect_bd_net -net ide_read_1 [get_bd_pins hps_ext/ide_rd] [get_bd_pins CORE_Main_Minimig/ide_read] [get_bd_pins CORE_Main_fastchip/ide_read]
connect_bd_net -net ide_write_1 [get_bd_pins hps_ext/ide_wr] [get_bd_pins CORE_Main_Minimig/ide_write] [get_bd_pins CORE_Main_fastchip/ide_write]
connect_bd_net -net ide_writedata_1 [get_bd_pins hps_ext/ide_dout] \
  [get_bd_pins CORE_Main_Minimig/ide_writedata] [get_bd_pins CORE_Main_fastchip/ide_writedata]
connect_bd_net [get_bd_pins iir_3275_logic/comb] \
  [get_bd_pins iir_filter_lpf3275/input_l] [get_bd_pins iir_filter_lpf3275/input_r] [get_bd_pins iir_comb_logic/comb]
connect_bd_net [get_bd_pins iir_4400_logic/comb] \
  [get_bd_pins iir_filter_lpf4400/input_l] [get_bd_pins iir_filter_lpf4400/input_r] [get_bd_pins iir_3275_logic/comb_i]
connect_bd_net [get_bd_pins iir_comb_logic/output_l] [get_bd_pins Audio_logic/output_l]
connect_bd_net [get_bd_pins iir_comb_logic/output_r] [get_bd_pins Audio_logic/output_r]
connect_bd_net [get_bd_pins iir_filter_lpf3275/output_l] [get_bd_pins iir_comb_logic/output_l_i]
connect_bd_net [get_bd_pins iir_filter_lpf3275/output_r] [get_bd_pins iir_comb_logic/output_r_i]
connect_bd_net [get_bd_pins iir_filter_lpf4400/output_l] [get_bd_pins iir_3275_logic/output_l]
connect_bd_net [get_bd_pins iir_filter_lpf4400/output_r] [get_bd_pins iir_3275_logic/output_r]
connect_bd_net -net joya2_1 [get_bd_pins hps_io/joystick_l_analog_1] [get_bd_pins CORE_Main_Minimig/joya2]
connect_bd_net -net kms_level_1 [get_bd_pins hps_ext/kbd_mouse_level] [get_bd_pins CORE_Main_Minimig/kms_level]
connect_bd_net -net mt32_sf_1 [get_bd_pins mt32pi/mt32_sf] [get_bd_pins status_menumask_logic/mt32_sf]
connect_bd_net [get_bd_pins mt32pi/USER_OUT] [get_bd_pins USER_OUT]
connect_bd_net [get_bd_pins mt32pi/mt32_i2s_l] [get_bd_pins Audio_logic/mt32_i2s_l]
connect_bd_net [get_bd_pins mt32pi/mt32_i2s_r] [get_bd_pins Audio_logic/mt32_i2s_r]
connect_bd_net [get_bd_pins mt32pi/mt32_mode] [get_bd_pins hps_io/info]
connect_bd_net [get_bd_pins mt32pi/mt32_newmode] [get_bd_pins hps_io/info_req]
connect_bd_net [get_bd_pins mt32pi/mt32_rom] [get_bd_pins status_menumask_logic/mt32_rom]
connect_bd_net -net nmi_addr_1 [get_bd_pins CORE_cpu_wrapper/nmi_addr] [get_bd_pins CORE_Main_Minimig/nmi_addr]
connect_bd_net [get_bd_pins pll_pll/locked] [get_bd_pins reset_logic/pll_locked]
connect_bd_net [get_bd_pins pll_pll/outclk_0] \
  [get_bd_pins CORE_ddram_ctrl_ram2/sysclk] [get_bd_pins CORE_sdram_ctrl_ram1/sysclk] [get_bd_pins CORE_Main_fastchip/clk] \
  [get_bd_pins CORE_video_mixer/CLK_VIDEO] [get_bd_pins CORE_video_freak/CLK_VIDEO] [get_bd_pins mt32pi/CLK_VIDEO] \
  [get_bd_pins CLK_VIDEO]
connect_bd_net [get_bd_pins pll_pll/outclk_1] \
  [get_bd_pins amiga_clk_0/clk_28] [get_bd_pins CORE_cpu_wrapper/clk] [get_bd_pins CORE_Main_fastchip/clk_sys] \
  [get_bd_pins CORE_Main_Minimig/clk] [get_bd_pins hps_io/clk_sys] [get_bd_pins hps_ext/clk_sys] [get_bd_pins cdda_0/CLK] \
  [get_bd_pins iir_filter_lpf4400/clk] [get_bd_pins iir_filter_lpf3275/clk]
connect_bd_net [get_bd_pins pll_pll/reconfig_from_pll] [get_bd_pins pll_cfg/reconfig_from_pll]
connect_bd_net -net reconfig_to_pll_1 [get_bd_pins pll_cfg/reconfig_to_pll] [get_bd_pins pll_pll/reconfig_to_pll]
connect_bd_net [get_bd_pins reset_logic/reset_o] \
  [get_bd_pins amiga_clk_0/reset_n] [get_bd_pins iir_filter_lpf4400/reset] [get_bd_pins iir_filter_lpf3275/reset] \
  [get_bd_pins CORE_Main_Minimig/rst_ext] [get_bd_pins cdda_0/nRESET] [get_bd_pins CORE_sdram_ctrl_ram1/reset_n] \
  [get_bd_pins CORE_ddram_ctrl_ram2/reset_n] [get_bd_pins mt32pi/reset]
connect_bd_net -net rxd_1 [get_bd_pins mt32pi/midi_rx] [get_bd_pins CORE_Main_Minimig/rxd]
connect_bd_net -net scandoubler_1 [get_bd_pins hps_io/forced_scandoubler] [get_bd_pins CORE_video_mixer/scandoubler]
connect_bd_net [get_bd_pins status_menumask_logic/status_menumask] [get_bd_pins hps_io/status_menumask]
connect_bd_net -net x_cpu_as_1 [get_bd_pins CORE_cpu_wrapper/chip_as] [get_bd_pins CORE_Main_Minimig/x_cpu_as]
connect_bd_net -net x_cpu_lds_1 [get_bd_pins CORE_cpu_wrapper/chip_lds] [get_bd_pins CORE_Main_Minimig/x_cpu_lds]
connect_bd_net -net x_cpu_reset_in_1 [get_bd_pins CORE_cpu_wrapper/reset_out] \
  [get_bd_pins CORE_Main_Minimig/x_cpu_reset_in] [get_bd_pins fastchip_reset_logic/wrapper_reset_out]
connect_bd_net -net x_cpu_uds_1 [get_bd_pins CORE_cpu_wrapper/chip_uds] [get_bd_pins CORE_Main_Minimig/x_cpu_uds]
connect_bd_net -net x_joy2_1 [get_bd_pins hps_io/joystick_1] [get_bd_pins CORE_Main_Minimig/x_joy2]
connect_bd_net -net x_joy3_1 [get_bd_pins hps_io/joystick_2] [get_bd_pins CORE_Main_Minimig/x_joy3]

current_bd_instance /emu/CORE_Main_Minimig
connect_bd_net [get_bd_pins CORE_Main_Minimig_DENISE/blue] [get_bd_pins blue]
connect_bd_net [get_bd_pins CORE_Main_Minimig_DENISE/data_out] [get_bd_pins gary_logic/denise_data_out]
connect_bd_net [get_bd_pins CORE_Main_Minimig_DENISE/green] [get_bd_pins green]
connect_bd_net [get_bd_pins CORE_Main_Minimig_DENISE/hires] [get_bd_pins res_o]
connect_bd_net [get_bd_pins CORE_Main_Minimig_DENISE/red] [get_bd_pins red]
connect_bd_net [get_bd_pins CORE_Main_Minimig_GAYLE/data_out] [get_bd_pins m68k_bridge_logic/Gayle_Data_In]
connect_bd_net [get_bd_pins CORE_Main_Minimig_GAYLE/ide_readdata] [get_bd_pins ide_readdata]
connect_bd_net [get_bd_pins CORE_Main_Minimig_GAYLE/ide_req] [get_bd_pins ide_req]
connect_bd_net [get_bd_pins CORE_Main_Minimig_GAYLE/led] [get_bd_pins hdd_led]
connect_bd_net [get_bd_pins CORE_Main_Minimig_Toccata/data_out] [get_bd_pins m68k_bridge_logic/Toccata_data_out]
connect_bd_net [get_bd_pins CORE_Main_Minimig_Toccata/out_left] [get_bd_pins toccata_aud_left]
connect_bd_net [get_bd_pins CORE_Main_Minimig_Toccata/out_right] [get_bd_pins toccata_aud_right]
connect_bd_net [get_bd_pins IO_DIN] [get_bd_pins paula_0/IO_DIN] [get_bd_pins userio_0/IO_DIN]
connect_bd_net [get_bd_pins IO_FPGA] [get_bd_pins paula_0/IO_ENA]
connect_bd_net [get_bd_pins IO_STROBE] [get_bd_pins paula_0/IO_STROBE] [get_bd_pins userio_0/IO_STROBE]
connect_bd_net [get_bd_pins IO_UIO] [get_bd_pins userio_0/IO_ENA]
connect_bd_net [get_bd_pins IO_WAIT_Logic/IO_WAIT] [get_bd_pins IO_WAIT]
connect_bd_net [get_bd_pins agnus_0/_csync] [get_bd_pins x_csync]
connect_bd_net [get_bd_pins agnus_0/_hsync] [get_bd_pins x_hsync] [get_bd_pins ciab_0/tick] [get_bd_pins CORE_Main_Minimig_Toccata/hsync]
connect_bd_net [get_bd_pins agnus_0/_vsync] [get_bd_pins x_vsync] [get_bd_pins ciaa_0/tick]
connect_bd_net [get_bd_pins agnus_0/address_out] [get_bd_pins gary_0/dma_address_in]
connect_bd_net [get_bd_pins agnus_0/data_out] [get_bd_pins gary_logic/agnus_data_out]
connect_bd_net [get_bd_pins agnus_0/dbr] [get_bd_pins gary_0/dbr] [get_bd_pins cart_0/dbr] [get_bd_pins minimig_m68k_bridge_0/dbr]
connect_bd_net [get_bd_pins agnus_0/dbwe] [get_bd_pins gary_0/dbwe]
connect_bd_net [get_bd_pins agnus_0/field1] [get_bd_pins field1]
connect_bd_net [get_bd_pins agnus_0/hblank] [get_bd_pins hblank]
connect_bd_net [get_bd_pins agnus_0/int3] [get_bd_pins paula_0/int3]
connect_bd_net [get_bd_pins agnus_0/lace] [get_bd_pins lace]
connect_bd_net [get_bd_pins agnus_0/reg_address_out] \
  [get_bd_pins CORE_Main_Minimig_DENISE/reg_address_in] [get_bd_pins paula_0/reg_address_in] \
  [get_bd_pins userio_0/reg_address_in]
connect_bd_net [get_bd_pins agnus_0/sof] [get_bd_pins paula_0/sof]
connect_bd_net [get_bd_pins agnus_0/strhor_denise] [get_bd_pins CORE_Main_Minimig_DENISE/strhor]
connect_bd_net [get_bd_pins agnus_0/strhor_paula] [get_bd_pins paula_0/strhor]
connect_bd_net [get_bd_pins agnus_0/vbl_int] [get_bd_pins paula_0/vblint]
connect_bd_net [get_bd_pins agnus_0/vblank] [get_bd_pins vblank]
connect_bd_net -net c1_1 [get_bd_pins c1] \
  [get_bd_pins minimig_sram_bridge_0/c1] [get_bd_pins minimig_m68k_bridge_0/c1] [get_bd_pins CORE_Main_Minimig_DENISE/c1]
connect_bd_net -net c3_1 [get_bd_pins c3] \
  [get_bd_pins minimig_sram_bridge_0/c3] [get_bd_pins minimig_m68k_bridge_0/c3] [get_bd_pins CORE_Main_Minimig_DENISE/c3]
connect_bd_net [get_bd_pins cart_0/int7] [get_bd_pins x_cpu_ipl_logic/cart_int1]
connect_bd_net [get_bd_pins cart_0/ovr] [get_bd_pins ovr]
connect_bd_net [get_bd_pins cart_0/sel_cart] [get_bd_pins minimig_bankmapper_0/cart]
connect_bd_net -net cart_data_in_1 [get_bd_pins cart_0/cart_data_out] [get_bd_pins m68k_bridge_logic/cart_data_in]
connect_bd_net [get_bd_pins cck] \
  [get_bd_pins paula_0/cck] [get_bd_pins agnus_0/cck] [get_bd_pins CORE_Main_Minimig_DENISE/cck] \
  [get_bd_pins minimig_m68k_bridge_0/cck]
connect_bd_net [get_bd_pins cd] [get_bd_pins ciab_0/porta_in]
connect_bd_net -net chip48_1 [get_bd_pins chip48] [get_bd_pins CORE_Main_Minimig_DENISE/chip48]
connect_bd_net [get_bd_pins ciaa_0/irq] [get_bd_pins paula_0/int2]
connect_bd_net [get_bd_pins ciaa_0/porta_out] [get_bd_pins userio_0/_fire0_dat] [get_bd_pins userio_0/_fire1_dat]
connect_bd_net [get_bd_pins ciaa_logic/porta_in] [get_bd_pins ciaa_0/porta_in]
connect_bd_net [get_bd_pins ciab_0/irq] [get_bd_pins paula_0/int6]
connect_bd_net [get_bd_pins ciab_0/porta_out] [get_bd_pins dtr] [get_bd_pins rts]
connect_bd_net [get_bd_pins ciab_0/portb_out] \
  [get_bd_pins paula_0/_motor] [get_bd_pins paula_0/_sel] [get_bd_pins paula_0/_step] [get_bd_pins paula_0/direc] \
  [get_bd_pins paula_0/side]
connect_bd_net [get_bd_pins clk7_en] \
  [get_bd_pins minimig_syscontrol_0/clk7_en] [get_bd_pins cart_0/clk7_en] [get_bd_pins minimig_m68k_bridge_0/clk7_en] \
  [get_bd_pins paula_0/clk7_en] [get_bd_pins agnus_0/clk7_en] [get_bd_pins CORE_Main_Minimig_DENISE/clk7_en] \
  [get_bd_pins ciaa_0/clk7_en] [get_bd_pins ciab_0/clk7_en] [get_bd_pins userio_0/clk7_en]
connect_bd_net [get_bd_pins clk7n_en] \
  [get_bd_pins minimig_m68k_bridge_0/clk7n_en] [get_bd_pins cart_0/clk7n_en] [get_bd_pins paula_0/clk7n_en] \
  [get_bd_pins ciaa_0/clk7n_en]
connect_bd_net [get_bd_pins clk] \
  [get_bd_pins minimig_syscontrol_0/clk] [get_bd_pins cart_0/clk] [get_bd_pins minimig_sram_bridge_0/clk] \
  [get_bd_pins minimig_m68k_bridge_0/clk] [get_bd_pins gary_0/clk] [get_bd_pins paula_0/clk] [get_bd_pins agnus_0/clk] \
  [get_bd_pins CORE_Main_Minimig_DENISE/clk] [get_bd_pins CORE_Main_Minimig_GAYLE/clk] [get_bd_pins ciaa_0/clk] \
  [get_bd_pins ciab_0/clk] [get_bd_pins CORE_Main_Minimig_Toccata/clk] [get_bd_pins userio_0/clk]
connect_bd_net [get_bd_pins cpu_address] [get_bd_pins minimig_m68k_bridge_0/address]
connect_bd_net [get_bd_pins cpu_r_w] [get_bd_pins minimig_m68k_bridge_0/r_w]
connect_bd_net [get_bd_pins cpudata_in] [get_bd_pins minimig_m68k_bridge_0/cpudatain]
connect_bd_net [get_bd_pins eclk] [get_bd_pins minimig_m68k_bridge_0/eclk] [get_bd_pins ciab_0/eclk] [get_bd_pins ciaa_0/eclk]
connect_bd_net [get_bd_pins gary_0/cpu_data_in] [get_bd_pins m68k_bridge_logic/gary_cpu_data_in]
connect_bd_net [get_bd_pins gary_0/custom_data_in] \
  [get_bd_pins paula_0/data_in] [get_bd_pins agnus_0/data_in] [get_bd_pins CORE_Main_Minimig_DENISE/data_in] \
  [get_bd_pins userio_0/data_in]
connect_bd_net [get_bd_pins gary_0/dbs] [get_bd_pins minimig_m68k_bridge_0/dbs]
connect_bd_net [get_bd_pins gary_0/ram_address_out] [get_bd_pins minimig_sram_bridge_0/address_in]
connect_bd_net [get_bd_pins gary_0/ram_data_in] [get_bd_pins minimig_sram_bridge_0/data_in]
connect_bd_net [get_bd_pins gary_0/ram_hwr] [get_bd_pins minimig_sram_bridge_0/hwr]
connect_bd_net [get_bd_pins gary_0/ram_lwr] [get_bd_pins minimig_sram_bridge_0/lwr]
connect_bd_net [get_bd_pins gary_0/ram_rd] [get_bd_pins minimig_sram_bridge_0/rd]
connect_bd_net [get_bd_pins gary_0/sel_chip] \
  [get_bd_pins minimig_bankmapper_0/chip1] [get_bd_pins minimig_bankmapper_0/chip2] [get_bd_pins minimig_bankmapper_0/chip3] \
  [get_bd_pins minimig_bankmapper_0/chip0]
connect_bd_net [get_bd_pins gary_0/sel_cia] [get_bd_pins minimig_m68k_bridge_0/vpa]
connect_bd_net [get_bd_pins gary_0/sel_cia_a] [get_bd_pins ciaa_0/aen]
connect_bd_net [get_bd_pins gary_0/sel_cia_b] [get_bd_pins ciab_0/aen]
connect_bd_net [get_bd_pins gary_0/sel_gayle] [get_bd_pins CORE_Main_Minimig_GAYLE/sel_gayle]
connect_bd_net [get_bd_pins gary_0/sel_ide] [get_bd_pins CORE_Main_Minimig_GAYLE/sel_ide]
connect_bd_net [get_bd_pins gary_0/sel_kick] [get_bd_pins minimig_bankmapper_0/kick]
connect_bd_net [get_bd_pins gary_0/sel_kick1mb] [get_bd_pins minimig_bankmapper_0/kick1mb]
connect_bd_net [get_bd_pins gary_0/sel_kick256kmirror] [get_bd_pins minimig_bankmapper_0/kick256kmirror]
connect_bd_net [get_bd_pins gary_0/sel_reg] [get_bd_pins agnus_0/aen]
connect_bd_net [get_bd_pins gary_0/sel_slow] \
  [get_bd_pins minimig_bankmapper_0/slow0] [get_bd_pins minimig_bankmapper_0/slow1] [get_bd_pins minimig_bankmapper_0/slow2]
connect_bd_net [get_bd_pins gary_0/xbs] [get_bd_pins minimig_m68k_bridge_0/xbs]
connect_bd_net [get_bd_pins gary_logic/custom_data_ouy] [get_bd_pins gary_0/custom_data_out]
connect_bd_net -net gayle_nrdy_1 [get_bd_pins CORE_Main_Minimig_GAYLE/nrdy] [get_bd_pins m68k_bridge_logic/gayle_nrdy]
connect_bd_net [get_bd_pins ide_address] [get_bd_pins CORE_Main_Minimig_GAYLE/ide_address]
connect_bd_net [get_bd_pins ide_read] [get_bd_pins CORE_Main_Minimig_GAYLE/ide_read]
connect_bd_net [get_bd_pins ide_write] [get_bd_pins CORE_Main_Minimig_GAYLE/ide_write]
connect_bd_net [get_bd_pins ide_writedata] [get_bd_pins CORE_Main_Minimig_GAYLE/ide_writedata]
connect_bd_net -net joya1_1 [get_bd_pins joya1] [get_bd_pins userio_0/joy_ana1]
connect_bd_net -net joya2_1 [get_bd_pins joya2] [get_bd_pins userio_0/joy_ana2]
connect_bd_net [get_bd_pins kbd_mouse_data] [get_bd_pins ciaa_0/kbd_mouse_data]
connect_bd_net [get_bd_pins kbd_mouse_type] [get_bd_pins ciaa_0/kbd_mouse_type] [get_bd_pins userio_0/kbd_mouse_type]
connect_bd_net [get_bd_pins kms_level] [get_bd_pins ciaa_0/kms_level] [get_bd_pins userio_0/kms_level]
connect_bd_net [get_bd_pins m68k_bridge_logic/bridge_nrdy] [get_bd_pins minimig_m68k_bridge_0/nrdy]
connect_bd_net [get_bd_pins m68k_bridge_logic/data_in] [get_bd_pins minimig_m68k_bridge_0/data_in]
connect_bd_net [get_bd_pins minimig_bankmapper_0/bank] [get_bd_pins minimig_sram_bridge_0/bank]
connect_bd_net [get_bd_pins minimig_m68k_bridge_0/_dtack] [get_bd_pins x_cpu_dtack]
connect_bd_net [get_bd_pins minimig_m68k_bridge_0/address_out] \
  [get_bd_pins CORE_Main_Minimig_GAYLE/addr] [get_bd_pins agnus_0/address_in] [get_bd_pins cart_0/cpu_address_in] \
  [get_bd_pins CORE_Main_Minimig_Toccata/addr]
connect_bd_net [get_bd_pins minimig_m68k_bridge_0/bls] [get_bd_pins agnus_0/bls]
connect_bd_net [get_bd_pins minimig_m68k_bridge_0/data] [get_bd_pins cpu_data]
connect_bd_net [get_bd_pins minimig_m68k_bridge_0/data_out] \
  [get_bd_pins gary_0/cpu_data_out] [get_bd_pins CORE_Main_Minimig_GAYLE/data_in] \
  [get_bd_pins CORE_Main_Minimig_Toccata/data_in]
connect_bd_net [get_bd_pins minimig_m68k_bridge_0/host_ack] [get_bd_pins userio_0/host_ack]
connect_bd_net [get_bd_pins minimig_m68k_bridge_0/host_rdat] [get_bd_pins userio_0/host_rdat]
connect_bd_net [get_bd_pins minimig_m68k_bridge_0/hwr] \
  [get_bd_pins cart_0/cpu_hwr] [get_bd_pins gary_0/cpu_hwr] [get_bd_pins CORE_Main_Minimig_GAYLE/wr] \
  [get_bd_pins agnus_0/hwr] [get_bd_pins CORE_Main_Minimig_Toccata/hwr]
connect_bd_net [get_bd_pins minimig_m68k_bridge_0/lwr] \
  [get_bd_pins cart_0/cpu_lwr] [get_bd_pins gary_0/cpu_lwr] [get_bd_pins agnus_0/lwr] \
  [get_bd_pins CORE_Main_Minimig_Toccata/lwr]
connect_bd_net [get_bd_pins minimig_m68k_bridge_0/rd] \
  [get_bd_pins cart_0/cpu_rd] [get_bd_pins gary_0/cpu_rd] [get_bd_pins CORE_Main_Minimig_GAYLE/rd] [get_bd_pins agnus_0/rd] \
  [get_bd_pins ciab_0/rd] [get_bd_pins CORE_Main_Minimig_Toccata/rd]
connect_bd_net [get_bd_pins minimig_m68k_bridge_0/rd_cyc] [get_bd_pins m68k_bridge_logic/bridge_rd_cyc]
connect_bd_net [get_bd_pins minimig_sram_bridge_0/_bhe] [get_bd_pins x_ram_bhe]
connect_bd_net [get_bd_pins minimig_sram_bridge_0/_ble] [get_bd_pins x_ram_ble]
connect_bd_net [get_bd_pins minimig_sram_bridge_0/_oe] [get_bd_pins x_ram_oe]
connect_bd_net [get_bd_pins minimig_sram_bridge_0/_we] [get_bd_pins x_ram_we]
connect_bd_net [get_bd_pins minimig_sram_bridge_0/address] [get_bd_pins ram_address]
connect_bd_net [get_bd_pins minimig_sram_bridge_0/data] [get_bd_pins ram_data]
connect_bd_net [get_bd_pins minimig_sram_bridge_0/data_out] [get_bd_pins gary_0/ram_data_out]
connect_bd_net [get_bd_pins minimig_syscontrol_0/reset] \
  [get_bd_pins gary_0/reset] [get_bd_pins paula_0/reset] [get_bd_pins agnus_0/reset] \
  [get_bd_pins CORE_Main_Minimig_DENISE/reset] [get_bd_pins CORE_Main_Minimig_GAYLE/reset] [get_bd_pins ciaa_0/reset] \
  [get_bd_pins ciab_0/reset] [get_bd_pins CORE_Main_Minimig_Toccata/rst] [get_bd_pins rst_out] [get_bd_pins userio_0/reset]
connect_bd_net [get_bd_pins mouse_btn] [get_bd_pins userio_0/mouse_btn]
connect_bd_net [get_bd_pins nmi_addr] [get_bd_pins cart_0/nmi_addr]
connect_bd_net [get_bd_pins paula_0/IO_DOUT] [get_bd_pins IO_DOUT]
connect_bd_net [get_bd_pins paula_0/IO_WAIT] [get_bd_pins IO_WAIT_Logic/Paula_IO_WAIT]
connect_bd_net [get_bd_pins paula_0/_change] [get_bd_pins ciaa_logic/paula_change]
connect_bd_net [get_bd_pins paula_0/_ipl] [get_bd_pins x_cpu_ipl_logic/paula_ipl]
